# Altium schematic sheet 前级仪表放大.SchDoc
size A4
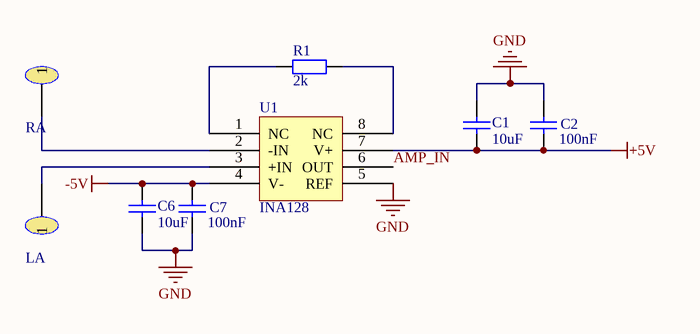
[diagram p0: 前级仪表放大.SchDoc]

## Parts
C1  10uF  [LC-0805_C]
C2  100nF  [LC-0805_C]
C6  10uF  [LC-0805_C]
C7  100nF  [LC-0805_C]
LA  ���Ժ���  [PAD]  (value not drawn)
R1  2k  [LC-0805_R]
RA  ���Ժ���  [PAD]  (value not drawn)
U1  INA128  [LC-SOIC-8_150mil]

## Nets
+5V: C1.2 C2.2 U1.7(V+)
-5V: C6.1 C7.1 U1.4(V-)
GND: C1.1 C2.1 C6.2 C7.2 U1.5(REF)
AMP_IN: U1.6(OUT)
NetLA_1: LA.1 U1.3(+IN)
NetR1_1: R1.1 U1.1(NC)
NetR1_2: R1.2 U1.8(NC)
NetRA_1: RA.1 U1.2(-IN)

## Library data of the parts
C1 C2 C6 C7 = Cap: 100nF��0805��50V,+/-10%
LA RA = TestPoint: ��������
R1 = Res1: 330��,0805,��5%
U1 = INA128: INA128��SO-8